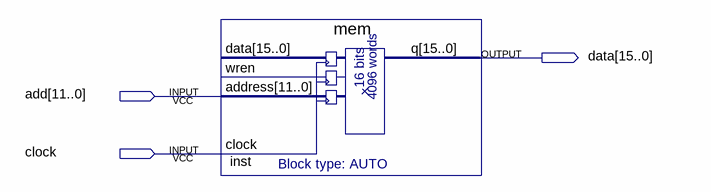
[diagram p0: schematic sheet]
// Quartus schematic test2.bdf as structural Verilog: 1 symbols, 3 pins
module test2 (
  input  [11:0] add,
  input  clock,
  output [15:0] data
);

  mem inst (.address(add), .clock(clock), .q(data));  // open: data, wren
endmodule
